# EAGLE design codm-wifi-pixel-controller (EAGLE 9.6.2)
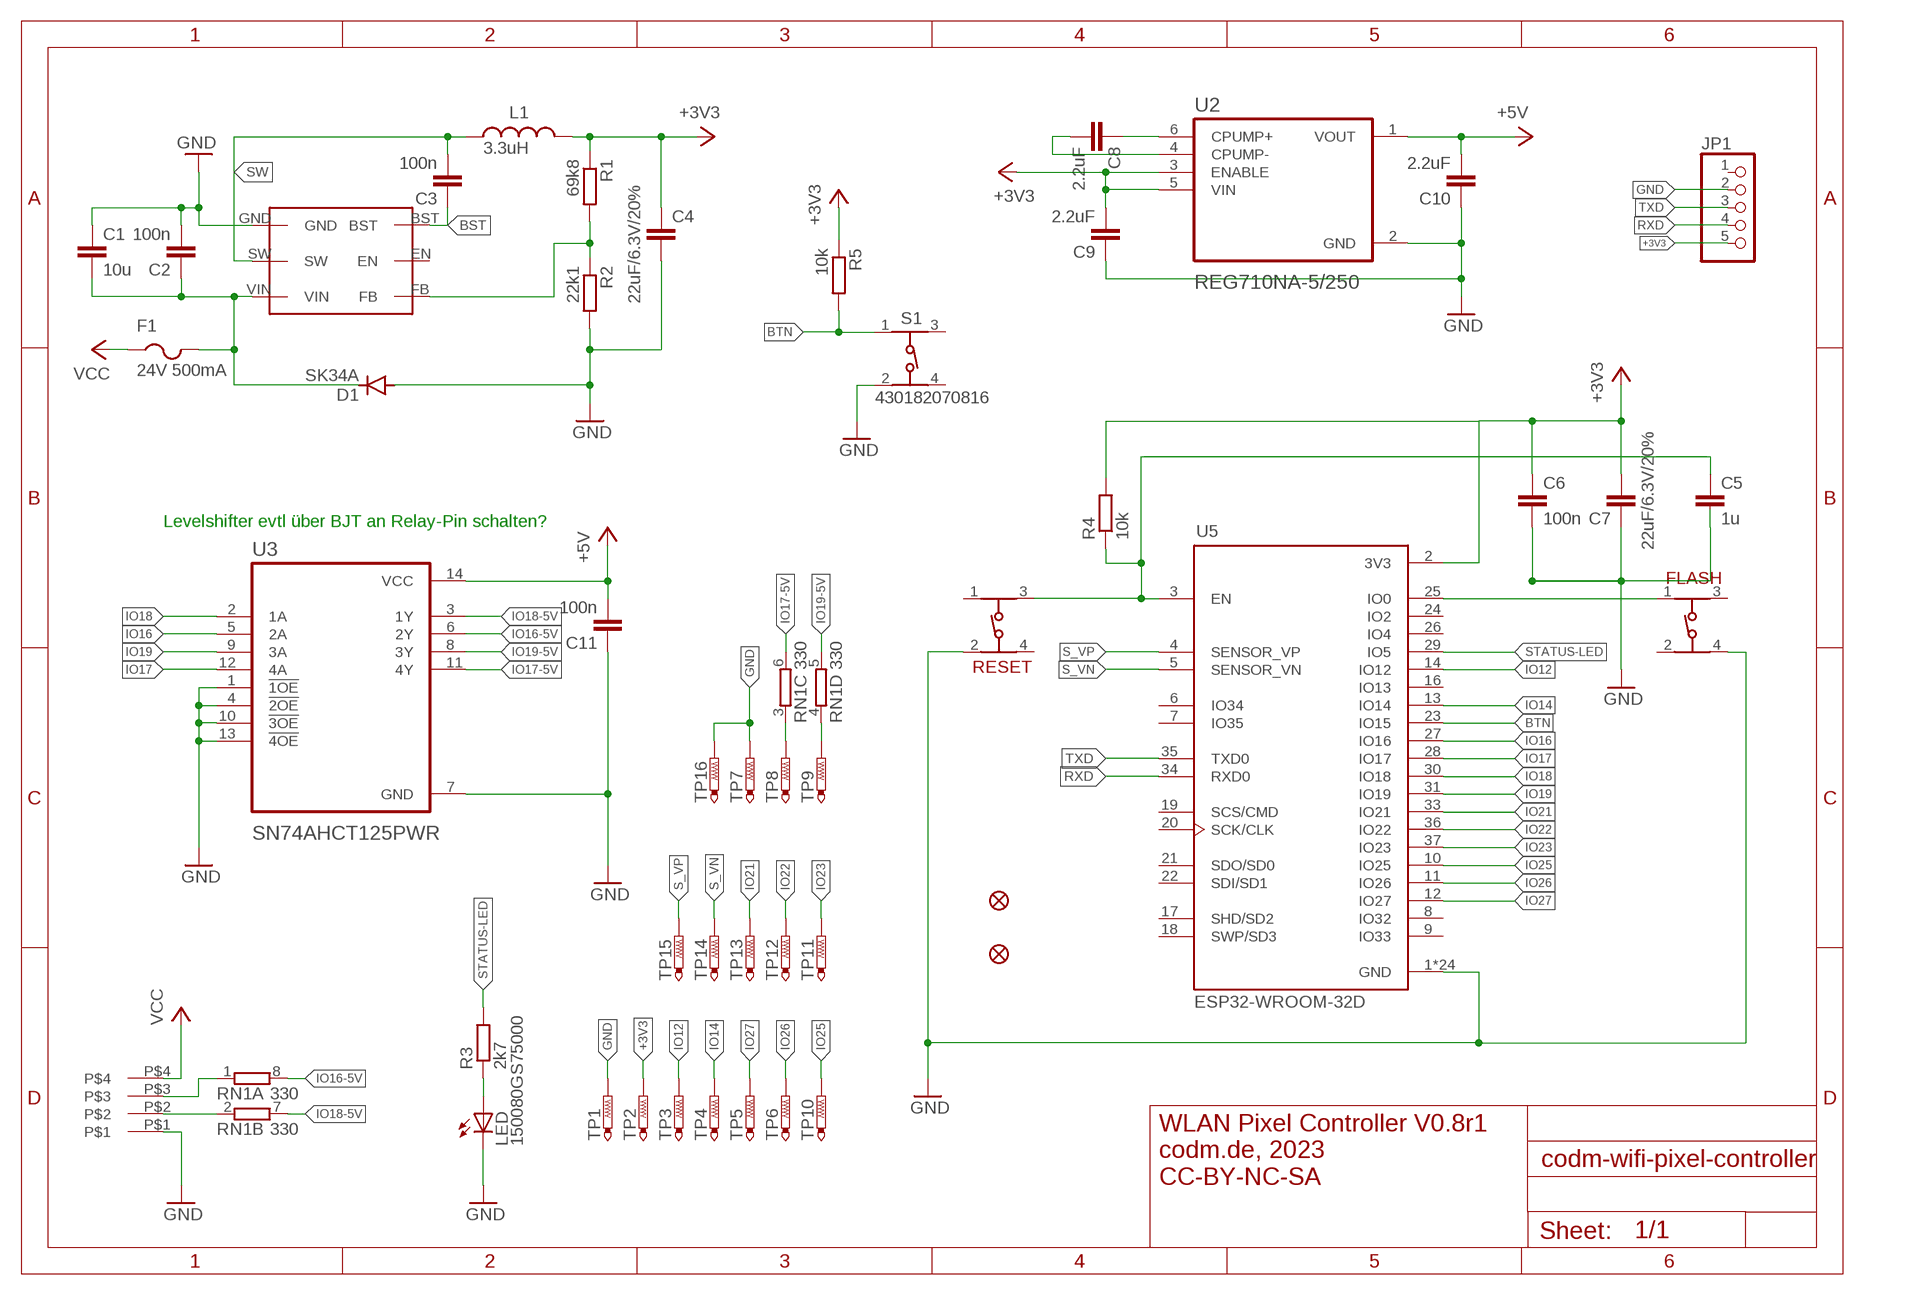
[diagram p0: schematic, sheet 1]

## Parts
C1  10u  C-EUC0805K  [C0805K]
C2  100n  C-EUC0603K  [C0603K]
C3  100n  C-EUC0603K  [C0603K]
C4  22uF/6.3V/20%  C-EUC0805K  [C0805K]
C5  1u  C-EUC0603K  [C0603K]
C6  100n  C-EUC0603K  [C0603K]
C7  22uF/6.3V/20%  C-EUC0805K  [C0805K]
C8  2.2uF  C-EUC0603K  [C0603K]
C9  2.2uF  C-EUC0603K  [C0603K]
C10  2.2uF  C-EUC0603K  [C0603K]
C11  100n  C-EUC0603K  [C0603K]
D1  SK34A  DIODE-DO214AC  [DO214AC]
F1  24V 500mA  PTCFUSE-1206  [R1206]
FD1  FIDUCIAL1X2  [FIDUCIAL-1X2]
FD2  FIDUCIAL1X2  [FIDUCIAL-1X2]
FLASH  434153017835  [434153017835]
JP1  PINHD-1X5  [1X05]
L1  3.3uH  WE-LQ_1812_744045003  [WE-LQ_1812]
LED  150080GS75000  LEDCHIP-LED0805  [CHIP-LED0805]
R1  69k8  R-EU_R0603  [R0603]
R2  22k1  R-EU_R0603  [R0603]
R3  2k7  R-EU_R0603  [R0603]
R4  10k  R-EU_R0603  [R0603]
R5  10k  R-EU_R0603  [R0603]
RESET  434153017835  [434153017835]
RN1  330  4R-NEXB38V  [EXB38V]
S1  430182070816  [430182070816]
TP1  PTR1TP14R  [TP14R]
TP2  PTR1TP14R  [TP14R]
TP3  PTR1TP14R  [TP14R]
TP4  PTR1TP14R  [TP14R]
TP5  PTR1TP14R  [TP14R]
TP6  PTR1TP14R  [TP14R]
TP7  PTR1TP14R  [TP14R]
TP8  PTR1TP14R  [TP14R]
TP9  PTR1TP14R  [TP14R]
TP10  PTR1TP14R  [TP14R]
TP11  PTR1TP14R  [TP14R]
TP12  PTR1TP14R  [TP14R]
TP13  PTR1TP14R  [TP14R]
TP14  PTR1TP14R  [TP14R]
TP15  PTR1TP14R  [TP14R]
TP16  PTR1TP14R  [TP14R]
U1  AP62XXX-TSOT26  [AP62XXX-TSOT26]
U2  REG710NA-5/250  [SOT95P280X145-6N]
U3  SN74AHCT125PWR  [SOP65P640X120-14N]
U5  ESP32-WROOM-32D  [MODULE_ESP32-WROOM-32D]
U$101  MCV-1,5/4-G-3,81  [MCV-1,5/4-G-3,81]

## Nets
+3V3: C4.1 C6.1 C7.2 C9.2 JP1.5 L1.2 R1.1 R4.2 R5.1 TP2.TP U2.3(ENABLE) U2.5(VIN) U5.2(3V3)
+5V: C10.2 C11.2 U2.1(VOUT) U3.14(VCC)
BST: C3.1 U1.BST
BTN: R5.2 S1.1 U5.23(IO15)
GND: C1.1 C2.2 C4.2 C5.2 C6.2 C7.1 C9.1 C10.1 C11.1 D1.A FLASH.4 JP1.2 LED.C R2.2 RESET.2 S1.2 TP1.TP TP7.TP TP16.TP U1.GND U2.2(GND) U3.1(!1OE) U3.4(!2OE) U3.7(GND) U3.10(!3OE) U3.13(!4OE) U5.1(GND) U5.15(GND) U5.38(GND) U5.39_1(GND) U5.39_2(GND) U5.39_3(GND) U5.39_4(GND) U5.39_5(GND) U5.39_6(GND) U5.39_7(GND) U5.39_8(GND) U5.39_9(GND) U5.39_10(GND) U5.39_11(GND) U5.39_12(GND) U5.39_13(GND) U5.39_14(GND) U5.39_15(GND) U5.39_16(GND) U5.39_17(GND) U5.39_18(GND) U5.39_19(GND) U5.39_20(GND) U5.39_21(GND) U$101.P$1
GPIO0: FLASH.1 U5.25(IO0)
IO12: TP3.TP U5.14(IO12)
IO14: TP4.TP U5.13(IO14)
IO16: U3.5(2A) U5.27(IO16)
IO16-5V: RN1.8 U3.6(2Y)
IO16-5VR: RN1.1 U$101.P$3
IO17: U3.12(4A) U5.28(IO17)
IO17-5V: RN1.6 U3.11(4Y)
IO17-5VR: RN1.3 TP8.TP
IO18: U3.2(1A) U5.30(IO18)
IO18-5V: RN1.7 U3.3(1Y)
IO18-5VR: RN1.2 U$101.P$2
IO19: U3.9(3A) U5.31(IO19)
IO19-5V: RN1.5 U3.8(3Y)
IO19-5VR: RN1.4 TP9.TP
IO21: TP13.TP U5.33(IO21)
IO22: TP12.TP U5.36(IO22)
IO23: TP11.TP U5.37(IO23)
IO25: TP10.TP U5.10(IO25)
IO26: TP6.TP U5.11(IO26)
IO27: TP5.TP U5.12(IO27)
N$5: C8.1 U2.6(CPUMP+)
N$6: R1.2 R2.1 U1.FB
N$7: LED.A R3.1
N$8: C8.2 U2.4(CPUMP-)
RESET: C5.1 R4.1 RESET.3 U5.3(EN)
RXD: JP1.4 U5.34(RXD0)
S_VN: TP14.TP U5.5(SENSOR_VN)
S_VP: TP15.TP U5.4(SENSOR_VP)
STATUS-LED: R3.2 U5.29(IO5)
SW: C3.2 L1.1 U1.SW
TXD: JP1.3 U5.35(TXD0)
VCC: F1.1 U$101.P$4
VCCF: C1.2 C2.1 D1.C F1.2 U1.VIN
Unconnected: FLASH.2 FLASH.3 JP1.1 RESET.1 RESET.4 S1.3 S1.4 U1.EN U5.6(IO34) U5.7(IO35) U5.8(IO32) U5.9(IO33) U5.16(IO13) U5.17(SHD/SD2) U5.18(SWP/SD3) U5.19(SCS/CMD) U5.20(SCK/CLK) U5.21(SDO/SD0) U5.22(SDI/SD1) U5.24(IO2) U5.26(IO4)

## Notes on the sheet
- Levelshifter evtl über BJT an Relay-Pin schalten?
- WLAN Pixel Controller V0.8r1
  codm.de, 2023
  CC-BY-NC-SA

## Library data of the parts
C1-C11 = rcl:C-EU: CAPACITOR, European symbol; SPICEPREFIX: C
D1 = diode:DIODE-: DIODE
F1 = adafruit:PTCFUSE: PTC fuses, resettable thermistors
FD1 FD2 = SparkFun-Aesthetics:FIDUCIAL: Fiducial Alignment Points Point-of-reference for pick-and-place machines and other optical instruments.
FLASH RESET = 434153017835_Eagle_WS-TASV_rev20a:434153017835: WS-TASV J-Bend SMT Tact Switch 3.5x2.9 mm Material Properties Cover Material : Stainless Steel Properties Actuator Material:LCP Actuator Flammability Rating:UL94 V-0 Actuator Color:Blue Frame Material:PA46 Frame Flammability Rating:UL94 HB Frame Color:Black Contact Material:Stainless Steel Contact Plating:Silver Terminal Material:Copper Alloy Terminal Plating:Silver VR:12 V (DC) Contact Resistance Initial:100 mΩ Contact Resistance After Life Test:1 Ω RISO:100 MΩ Withstanding Voltage:250 V (AC) Washable:No Qty.:4000 Mechanical Properties Stroke :0.15 mm General Information Operating Temperature:-40 up to +85 °C Washable:No Packaging Properties Packaging:Tape and Reel <https://www.we-online.com/catalog/media/o72753v209%20WS-TASU_434331013822_a_4C.jpg> Details see: https://www.we-online.com/catalog/en/TASV_3_5X2_9_SMD_J-BEND/ Updated by yingchun,Shan;2020-02-18 2020(C) Würth Elektronik; DATASHEET-URL: https://www.we-online.com/catalog/datasheet/434153017835.pdf; H: 1.7mm; OPERATION-FORCE: 350g; PART-NUMBER: 434153017835; QTY: 4000
JP1 = codm:PINHD-1X5: PIN HEADER
L1 = Eagle_WE-LQ (rev19a):WE-LQ_1812: WE-LQ SMD Inductor Characteristics Miniature chip inductor wound on a special ferrite core Small inductances for compact circuits High Q at high frequencies Low DC-resistance Operating temperature: –40 ºC to +125 ºC Recommended solder profile: Reflow Applications Low power DC/DC-converters from Linear Technology, National Semiconductor, Texas Instruments, Fairchild Semiconductor, ON Semiconductor, STMicroelectronics, Maxim, MPS, Semtech, Exar, Analogic Tech, Diodes and Cologne Chip EMI-Filtering RF-circuits <https://katalog.we-online.com/media/images/v2/o14806v209%20Family_we-lq_smd_induktivitaet.jpg> Details see: https://katalog.we-online.com/en/pbs/WE-LQ Updated by Yingchun Shan 2019-07-16 2019 (C) Wurth Elektronik; DATASHEET-URL: https://katalog.we-online.com/pbs/datasheet/744045003.pdf; FRES: 58MHz; IR: 1.4A; ISAT: 2.7A; PART-NUMBER: 744045003; Q: 45; RDC-MAX: 0.13Ohm
LED = led:LED: LED OSRAM: - CHIPLED LG R971, LG N971, LY N971, LG Q971, LY Q971, LO R971, LY R971 LH N974, LH R974 LS Q976, LO Q976, LY Q976 LO Q996 - Hyper CHIPLED LW Q18S LB Q993, LB Q99A, LB R99A - SideLED LS A670, LO A670, LY A670, LG A670, LP A670 LB A673, LV A673, LT A673, LW A673 LH A674 LY A675 LS A676, LA A676, LO A676, LY A676, LW A676 LS A679, LY A679, LG A679 - Hyper Micro SIDELED® LS Y876, LA Y876, LO Y876, LY Y876 LT Y87S - SmartLED LW L88C, LW L88S LB L89C, LB L89S, LG L890 LS L89K, LO L89K, LY L89K LS L896, LA L896, LO L896, LY L896 - TOPLED LS T670, LO T670, LY T670, LG T670, LP T670 LSG T670, LSP T670, LSY T670, LOP T670, LYG T670 LG T671, LOG T671, LSG T671 LB T673, LV T673, LT T673, LW T673 LH T674 LS T676, LA T676, LO T676, LY T676, LB T676, LH T676, LSB T676, LW T676 LB T67C, LV T67C, LT T67C, LS T67K, LO T67K, LY T67K, LW E67C LS E67B, LA E67B, LO E67B, LY E67B, LB E67C, LV E67C, LT E67C LW T67C LS T679, LY T679, LG T679 LS T770, LO T770, LY T770, LG T770, LP T770 LB T773, LV T773, LT T773, LW T773 LH T774 LS E675, LA E675, LY E675, LS T675 LS T776, LA T776, LO T776, LY T776, LB T776 LHGB T686 LT T68C, LB T68C - Hyper Mini TOPLED® LB M676 - Mini TOPLED Santana® LG M470 LS M47K, LO M47K, LY M47K Source: http://www.osram.convergy.de LUXEON: - LUMILED® LXK2-PW12-R00, LXK2-PW12-S00, LXK2-PW14-U00, LXK2-PW14-V00 LXK2-PM12-R00, LXK2-PM12-S00, LXK2-PM14-U00 LXK2-PE12-Q00, LXK2-PE12-R00, LXK2-PE12-S00, LXK2-PE14-T00, LXK2-PE14-U00 LXK2-PB12-K00, LXK2-PB12-L00, LXK2-PB12-M00, LXK2-PB14-N00, LXK2-PB14-P00, LXK2-PB14-Q00 LXK2-PR12-L00, LXK2-PR12-M00, LXK2-PR14-Q00, LXK2-PR14-R00 LXK2-PD12-Q00, LXK2-PD12-R00, LXK2-PD12-S00 LXK2-PH12-R00, LXK2-PH12-S00 LXK2-PL12-P00, LXK2-PL12-Q00, LXK2-PL12-R00 Source: www.luxeon.com KINGBRIGHT: KA-3528ASYC Source: www.kingbright.com
R1-R5 = rcl:R-EU_: RESISTOR, European symbol; SPICEPREFIX: R
RN1 = resistor-dil:4R-N: Array Chip Resistor Source: RS Component / Phycomp; OC_FARNELL: unknown; OC_NEWARK: unknown
S1 = Eagle_WS-TASV (rev21c):430182070816: WS-TASV SMT Tact Switch 6x6 mm Material Properties Cover Material : Stainless Steel Properties Actuator Material:LCP Actuator Flammability :UL94 V-0 Rating Actuator Color:Black; Salmon; White Frame Material:LCP Flammability Rating:UL94 V-0 Frame Color:Black Contact Material:Stainless Steel Contact Plating:Silver Terminal Material:Copper Alloy Terminal Plating:Silver VR:12 V (DC) Contact Resistance Initial:100 mΩ Contact Resistance After Life Test:2Ω RISO:100 MΩ Withstanding Voltage:250 V (AC) Washable:No Qty.:4000;5000 Mechanical Properties Electrical Life:400; 550; 1000 Stroke :0.25 mm General Information Operating Temperature:-40 up to +85 °C Washable:No Packaging Properties Packaging:Tape and Reel <https://www.we-online.com/catalog/media/o37470v209%20Family_WS-TASV_6x6mm_SMD_Tact_Switch_4301820xx8xx.jpg> Details see: https://www.we-online.com/catalog/en/TASV_6X6_SMD/ Updated by yingchun,Shan;2020-02-18 2020(C) Würth Elektronik; DATASHEET-URL: https://www.we-online.com/catalog/datasheet/430182070816.pdf; H: 7mm; OPERATION-FORCE: 160g; PART-NUMBER: 430182070816; QTY: 550
TP1-TP16 = testpad:PTR1: TEST PIN
U1 = codm:AP62XXX-TSOT26
U2 = REG710NA-5_250:REG710NA-5/250: Check prices <https://pricing.snapeda.com/parts/REG710NA-5/250/Texas%20Instruments/view-part?ref=eda>; AVAILABILITY: In Stock; DESCRIPTION: 30-mA Switched-Cap DC-DC Converter with fixed 5-V Output 6-SOT-23 -40 to 85; MF: Texas Instruments; MP: REG710NA-5/250; PACKAGE: SOT-23-6 Texas Instruments; PRICE: None; PURCHASE-URL: https://pricing.snapeda.com/search/part/REG710NA-5/250/?ref=eda
U3 = SN74AHCT125PWR:SN74AHCT125PWR: Check availability <https://pricing.snapeda.com/parts/SN74AHCT125PWR/Texas%20Instruments/view-part?ref=eda>; AVAILABILITY: In Stock; DESCRIPTION: Quadruple Bus Buffer Gates With 3-State Outputs 14-TSSOP -40 to 125; MF: Texas Instruments; MP: SN74AHCT125PWR; PACKAGE: TSSOP-14 Texas Instruments; PRICE: None; PURCHASE-URL: https://pricing.snapeda.com/search/part/SN74AHCT125PWR/?ref=eda
U5 = ESP32-WROOM-32D:ESP32-WROOM-32D: Bluetooth, WiFi 802.11b/g/n, Bluetooth v4.2 + EDR, Class 1, 2 and 3 Transceiver Module 2.4GHz ~ 2.5GHz Integrated, Trace Surface Mount Check availability <https://pricing.snapeda.com/parts/ESP32-WROOM-32D/Espressif%20Systems/view-part?ref=eda>; AVAILABILITY: In Stock; DESCRIPTION: Bluetooth, WiFi 802.11b/g/n, Bluetooth v4.2 +EDR, Class 1, 2 and 3 Transceiver Module 2.4GHz ~ 2.5GHz Integrated; MF: Espressif Systems; MP: ESP32-WROOM-32D; PACKAGE: Module Espressif Systems; PRICE: None; PURCHASE-URL: https://pricing.snapeda.com/search/part/ESP32-WROOM-32D/?ref=eda
U$101 = codm:MCV-1,5/4-G-3,81

## Board
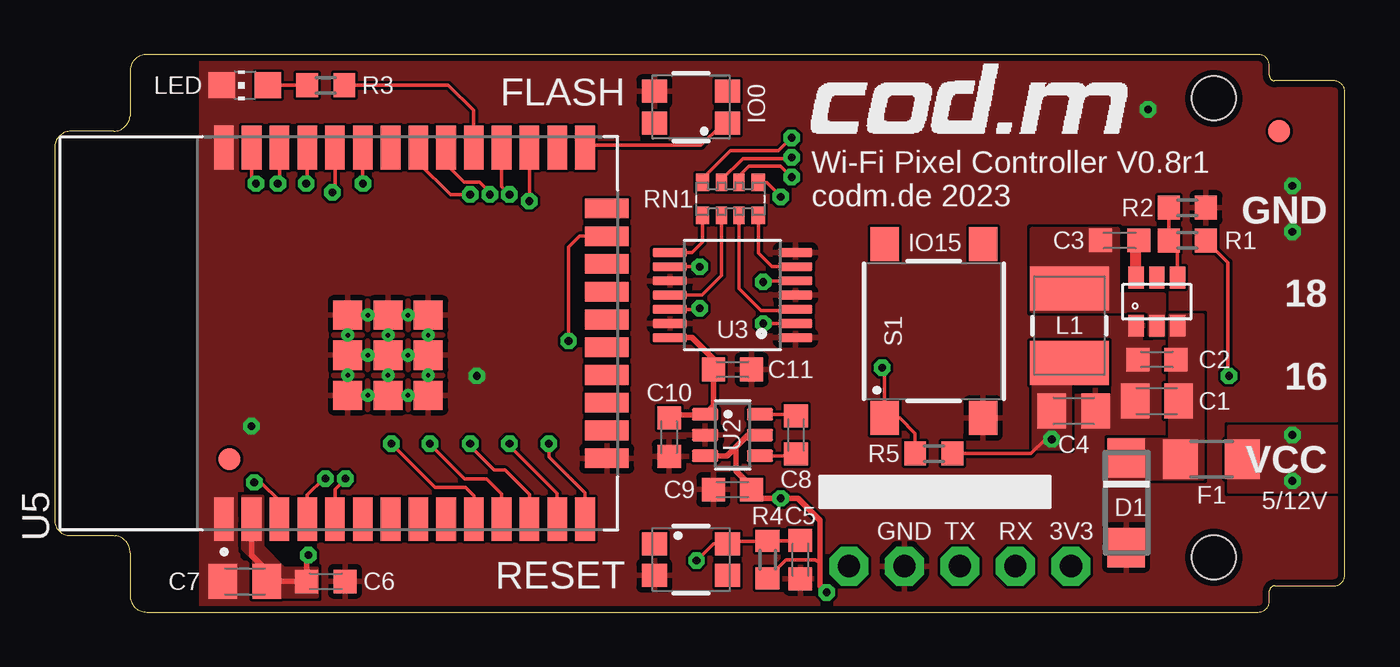
[diagram p1: board, top side]
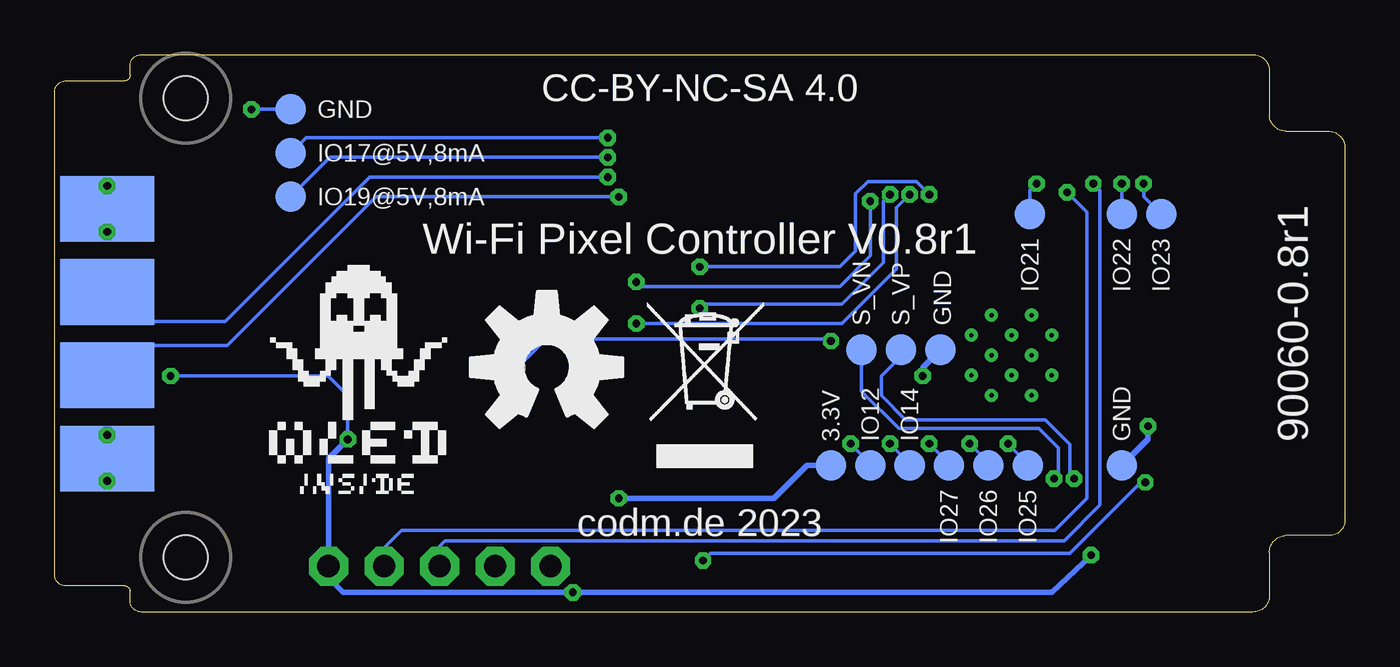
[diagram p2: board, bottom side, seen from below]

Size 59 x 25.5 mm. Coordinates in mm from the lower left corner, seen from the top.
Outline: 2.7,22 0.75,22 0.69,22 arc85 0,21.25 0,4.2 arc90 0.7,3.5 2.7,3.5 2.77,3.5 arc-85 3.45,2.7 3.45,0.75 3.45,0.69 arc85 4.2,0 55.05,0 55.09,0 arc85 55.55,0.5 55.55,0.95 55.55,0.97 arc-85 55.8,1.2 58.5,1.2 58.54,1.2 arc85 59,1.7 59,23.8 59,23.84 arc85 58.5,24.3 55.8,24.3 55.78,24.3 arc-85 55.55,24.55 55.55,25 55.55,25.04 arc85 55.05,25.5 4.2,25.5 4.13,25.5 arc85 3.45,24.75 3.45,22.75 3.45,22.68 arc-85 2.7,22
Copper layers (1*16): Top 0.035mm / dielectric 1.5mm / Bottom 0.035mm
Design rules "aisler_2_layer_complex": minimum track width 0.125mm, minimum drill 0.2mm, track to track 0.125mm, track to pad 0.125mm, pad to pad 0.125mm, via to via 0.125mm, smd to smd 0.125mm, copper to edge 0.3mm, drill to drill 0.25mm, minimum pad ring 0.2mm, minimum via ring 0.2mm, stop-mask expansion 0mil, vias tented up to drill 0mil, thermal gap 10mil
Holes 2 mm at 53,23.5 53,2.5

### Footprints (pad centres in the part's own frame; a part is rotated, then mirrored left to right if it is on the bottom)
C0805K = smd 1.3 x 1.6: 1 -1,0; 2 1,0
C0603K = smd 1.05 x 1.08: 1 -0.875,0; 2 0.875,0
DO214AC = smd 1.8 x 1.7: A 2.05,0; C -2.05,0
R1206 = smd 1.6 x 1.803: 1 -1.422,0; 2 1.422,0
FIDUCIAL-1X2 = smd 1 x 1: 1 0,0
434153017835 = smd 1.15 x 1.05: 1 -1.675,0.725; 2 -1.675,-0.725; 3 1.675,0.725; 4 1.675,-0.725
1X05 = drill 1.016 pad 1.778 octagon: 1 -5.08,0; 2 -2.54,0; 3 0,0; 4 2.54,0; 5 5.08,0
WE-LQ_1812 = smd 2 x 3.6: 1 -1.7,0; 2 1.7,0
CHIP-LED0805 = smd 1.2 x 1.2: A 0,-1.05; C 0,1.05
R0603 = smd 1 x 1.1: 1 -0.85,0; 2 0.85,0
EXB38V = smd 0.6 x 0.8: 1 -1.275,-0.75; 4 1.275,-0.75; 5 1.275,0.75; 8 -1.275,0.75 | smd 0.5 x 0.8: 2 -0.4,-0.75; 3 0.4,-0.75; 6 0.4,0.75; 7 -0.4,0.75
430182070816 = smd 1.55 x 1.3: 1 -3.975,2.25; 2 -3.975,-2.25; 3 3.975,2.25; 4 3.975,-2.25
TP14R = smd 1.4 x 1.4: TP 0,0
AP62XXX-TSOT26 = smd 1 x 0.7: BST 1.1,0.95; EN 1.1,0; FB 1.1,-0.95; GND -1.1,0.95; SW -1.1,0; VIN -1.1,-0.95
SOT95P280X145-6N = smd 1.21 x 0.58: 1 -1.255,0.95; 2 -1.255,0; 3 -1.255,-0.95; 4 1.255,-0.95; 5 1.255,0; 6 1.255,0.95
SOP65P640X120-14N = smd 1.57 x 0.41: 1 -2.87,1.95; 2 -2.87,1.3; 3 -2.87,0.65; 4 -2.87,0; 5 -2.87,-0.65; 6 -2.87,-1.3; 7 -2.87,-1.95; 8 2.87,-1.95; 9 2.87,-1.3; 10 2.87,-0.65; 11 2.87,0; 12 2.87,0.65; 13 2.87,1.3; 14 2.87,1.95
MODULE_ESP32-WROOM-32D = smd 2 x 0.9: 1 -8.5,5.26; 2 -8.5,3.99; 3 -8.5,2.72; 4 -8.5,1.45; 5 -8.5,0.18; 6 -8.5,-1.09; 7 -8.5,-2.36; 8 -8.5,-3.63; 9 -8.5,-4.9; 10 -8.5,-6.17; 11 -8.5,-7.44; 12 -8.5,-8.71; 13 -8.5,-9.98; 14 -8.5,-11.25; 25 8.5,-11.25; 26 8.5,-9.98; 27 8.5,-8.71; 28 8.5,-7.44; 29 8.5,-6.17; 30 8.5,-4.9; 31 8.5,-3.63; 32 8.5,-2.36; 33 8.5,-1.09; 34 8.5,0.18; 35 8.5,1.45; 36 8.5,2.72; 37 8.5,3.99; 38 8.5,5.26 | smd 0.9 x 2: 15 -5.715,-12.25; 16 -4.445,-12.25; 17 -3.175,-12.25; 18 -1.905,-12.25; 19 -0.635,-12.25; 20 0.635,-12.25; 21 1.905,-12.25; 22 3.175,-12.25; 23 4.445,-12.25; 24 5.715,-12.25 | smd 1.33 x 1.33: 39_1 -2.835,-0.405; 39_2 -1,-0.405; 39_3 0.835,-0.405; 39_4 -2.835,-2.24; 39_5 -1,-2.24; 39_6 0.835,-2.24; 39_7 -2.835,-4.075; 39_8 -1,-4.075; 39_9 0.835,-4.075 | drill 0.2 pad 0.3: 39_10 -1.917,-0.405; 39_11 -0.083,-0.405; 39_12 -2.835,-1.323; 39_13 -1,-1.323; 39_14 0.835,-1.323; 39_15 -1.917,-2.24; 39_16 -0.083,-2.24; 39_17 -2.835,-3.158; 39_18 -1,-3.158; 39_19 0.835,-3.158; 39_20 -1.917,-4.075; 39_21 -0.083,-4.075
MCV-1,5/4-G-3,81 = smd 4.3 x 3: P$1 0,-5.7; P$2 0,-1.89; P$3 0,1.92; P$4 0,5.73

### Placement (x,y rotation side)
C1  50.4,9.65 0 top
C2  50.4,11.55 180 top
C3  48.7,17 180 top
C4  46.6,9.2 0 top
C5  34.1,2.4 270 top
C6  12.4,1.4 0 top
C7  8.7,1.4 0 top
C8  33.9,8.1 270 top
C9  31,5.6 0 top
C10  28.1,8 90 top
C11  31,11.1 180 top
D1  49,5 270 top
F1  52.9,7 180 top
FD1  8,7 0 top
FD2  56,22 0 top
FLASH  29.1,23.1 180 top
JP1  41.4,2.1 0 top
L1  46.4,13.1 270 top
LED  8.7,24.1 90 top
R1  51.8,17 180 top
R2  51.8,18.5 0 top
R3  12.4,24.1 0 top
R4  32.6,2.4 270 top
R5  40.2,7.25 180 top
RESET  29.1,2.4 0 top
RN1  30.9,18.9 180 top
S1  40.2,12.85 90 top
TP1  10.2,6.7 0 bottom
TP2  23.5,6.7 0 bottom
TP3  21.7,6.7 0 bottom
TP4  19.9,6.7 0 bottom
TP5  18.1,6.7 0 bottom
TP6  16.3,6.7 0 bottom
TP7  48.2,23 0 bottom
TP8  48.2,19 0 bottom
TP9  48.2,21 0 bottom
TP10  14.5,6.7 0 bottom
TP11  8.4,18.2 0 bottom
TP12  10.2,18.2 0 bottom
TP13  14.4,18.2 0 bottom
TP14  22.1,12 0 bottom
TP15  20.3,12 0 bottom
TP16  18.5,12 0 bottom
U1  50.4,14.2 90 top
U2  31,8.1 0 top
U3  31,14.5 180 top
U5  13,12.75 90 top
U$1  [CODM-LOGO]  34.6,21.9 0 top
U$2  [WLED-INSIDE-LOGO-10MM]  49.3,5.2 0 bottom
U$100  [WEEE-LOGO-5MM]  31.9,6.6 0 bottom
U$101  56.6,12.75 180 bottom
U$102  [OSHW-LOGO-L]  36.5,11.2 0 bottom

### Tracks (layer width: path | path; a pad name or v marks a point on that pad's centre or on a via)
+3V3  (via drill 0.35)
  Top 0.152: R1.1 53.65,16 53.65,10.85 v53.7,10.8 | R5.1 44.65,7.25 45.3,7.9 v45.6,7.9 | R4.2 33.45,2.4 34.8,2.4 35,2.2
  Top 0.254: v11.6,2.6 11.53,2.52 C6.1 C7.2 9.7,1.9 9.01,2.59 U5.2 | U2.5 31.7,8.1 31.15,7.55 | U2.3 30.75,7.15 31.15,7.55 | 31.15,7.55 31.15,6.45 32,5.6 | 32,5.6 32.4,5.2 v33.2,5.2 34,5.2 35,4.2 35,2.2 35,1.2 v35.3,0.9 | C9.2 32,5.6
  Bottom 0.152: v53.7,10.8 46.5,10.8 45.6,9.9 v45.6,7.9
  Bottom 0.254: v11.6,2.6 13.4,0.9 v35.3,0.9 45.8,0.9 46.48,1.58 JP1.5 46.48,7.02 v45.6,7.9 | TP2.TP 24.6,6.7 26.1,5.2 v33.2,5.2
  pour Top (no thermals): 46.4,7.5 44.8,7.5 44.8,12.3 48.1,12.3 48.1,10.6 46.4,10.6
  pour Top (no thermals): 9.1,0.7 9.1,2.4 8.6,2.9 8.6,5.3 9.5,5.3 9.5,3 10.5,2 12,2 12,0.7
+5V
  Top 0.152: U2.1 29.71,9.02 | 28.15,9.02 C10.2
  Top 0.254: 29.71,9.02 28.15,9.02 | U3.14 29.15,12.55 30.12,11.57 C11.2 30.12,9.43 U2.1
BST
  Top 0.254: 49.45,16.88 C3.1
  Top 0.508: U1.BST 49.45,16.88
BTN  (via drill 0.35)
  Top 0.152: v23.5,12.4 23.5,16.7 23.9,17.1 24,17.2 U5.23 | R5.2 39.35,8.18 38.65,8.88 S1.1 37.95,11.07 v37.85,11.18
  Bottom 0.152: v23.5,12.4 23.6,12.5 36.52,12.5 v37.85,11.18
GND  (via drill 0.35)
  Bottom 0.152: TP7.TP v50,23
  Bottom 0.254: TP1.TP 9,7.9 v9,8.5 | TP16.TP 19.3,11.2 v19.3,10.8
  Bottom 0.508: v56.6,17.4 U$101.P$1 v56.6,19.5
  pour Top (rank 3): 6.73,0 59,0 59,25.4 6.73,25.4
  pour Top (rank 2, no thermals): 44.6,9.9 44.6,5.6 50.6,5.6 50.6,12.35 49.7,12.35 49.7,13.4 48.4,13.4 48.4,9.9
  pour Top (no thermals): 6.7,-0.1 6.7,5.5 8.3,5.5 8.3,2.6 8.6,2.3 8.6,-0.1
  pour Top (no thermals): 6.7,20 8.8,20 8.8,24.9 6.7,24.9
GPIO0
  Top 0.152: FLASH.1 30.48,22.26 29.56,21.35 24.35,21.35 U5.25
IO12  (via drill 0.35)
  Top 0.152: U5.14 24.25,5.45 22.6,7.1 v22.6,7.7
  Bottom 0.152: v22.6,7.7 21.7,6.8 TP3.TP
IO14  (via drill 0.35)
  Top 0.152: U5.13 22.98,5.42 20.8,7.6 v20.8,7.7
  Bottom 0.152: TP4.TP 19.9,6.8 v20.8,7.7
IO16  (via drill 0.35)
  Top 0.152: v32.4,15.1 32.45,15.15 U3.5 | U5.27 v21.71,18.81 v21.7,18.8
  Bottom 0.152: v21.7,18.8 21.7,16.3 23.1,14.9 32.2,14.9 v32.4,15.1
IO16-5V
  Top 0.152: RN1.8 32.17,16.43 32.8,15.8 U3.6
IO16-5VR  (via drill 0.35)
  Top 0.152: v33.2,19 33.2,19.02 32.58,19.65 RN1.1
  Bottom 0.152: U$101.P$3 55.7,11.73 55.7,12.1 55.6,12.2 51.1,12.2 44.3,19 v33.2,19
IO17  (via drill 0.35)
  Top 0.152: v29.5,13.9 29.45,13.85 U3.12 | v20.8,19.1 20.44,19.46 U5.28
  Bottom 0.152: v20.8,19.1 21.1,18.8 21.1,16 23,14.1 29.3,14.1 v29.5,13.9
IO17-5V
  Top 0.152: RN1.6 30.5,15.4 29.6,14.5 U3.11
IO17-5VR  (via drill 0.35)
  Top 0.152: RN1.3 30.5,19.79 31.47,20.75 33.65,20.75 v33.7,20.8
  Bottom 0.152: v33.7,20.8 46.4,20.8 TP8.TP
IO18  (via drill 0.35)
  Top 0.152: v19.9,19.1 19.9,19.21 19.44,19.68 18.72,19.68 17.9,20.5 U5.30 | v32.4,13.2 U3.2
  Bottom 0.152: v19.9,19.1 20.5,18.5 20.5,15.7 23,13.2 v32.4,13.2
IO18-5V
  Top 0.152: RN1.7 31.3,14.8 32.3,13.8 33.82,13.8 U3.3
IO18-5VR  (via drill 0.35)
  Top 0.152: v33.7,19.9 33.2,20.4 31.75,20.4 31.3,19.95 RN1.2
  Bottom 0.152: v33.7,19.9 44.6,19.9 51.2,13.3 56.6,13.3 U$101.P$2
IO19  (via drill 0.35)
  Top 0.152: v19,19.1 18.1,19.1 16.63,20.57 U5.31 | v29.5,15.8 U3.9
  Bottom 0.152: v19,19.1 19.6,19.7 21.82,19.7 22.38,19.14 22.38,16.52 23.1,15.8 v29.5,15.8
IO19-5V
  Top 0.152: U3.8 29.15,16.45 29.62,16.93 RN1.5
IO19-5VR  (via drill 0.35)
  Top 0.152: RN1.4 29.62,19.82 30.9,21.1 33.1,21.1 v33.7,21.7
  Bottom 0.152: TP9.TP 47.5,21.7 v33.7,21.7
IO21  (via drill 0.35)
  Top 0.152: U5.33 v14.09,19.61 v14.1,19.6
  Bottom 0.152: v14.1,19.6 14.4,19.3 TP13.TP
IO22  (via drill 0.35)
  Top 0.152: U5.36 10.28,19.68 v10.2,19.6
  Bottom 0.152: v10.2,19.6 TP12.TP
IO23  (via drill 0.35)
  Top 0.152: U5.37 9.01,19.79 v9.2,19.6
  Bottom 0.152: v9.2,19.6 9.2,19 TP11.TP
IO25  (via drill 0.35)
  Top 0.152: U5.10 19.17,5.32 18.79,5.7 17.4,5.7 v15.4,7.7
  Bottom 0.152: TP10.TP 14.5,6.8 v15.4,7.7
IO26  (via drill 0.35)
  Top 0.152: v17.15,7.7 18.75,6.1 19.75,6.1 20.44,5.42 U5.11
  Bottom 0.152: TP6.TP 16.3,6.85 v17.15,7.7
IO27  (via drill 0.35)
  Top 0.152: U5.12 21.71,5.39 20.6,6.5 20.1,6.5 19,7.6 v19,7.7
  Bottom 0.152: v19,7.7 18.1,6.8 TP5.TP
N$5
  Top 0.152: U2.6 33.83,9.05 C8.1
N$6
  Top 0.152: U1.FB 51.35,16.6 R1.2 R2.1
N$7
  Top 0.152: LED.A R3.1
N$8
  Top 0.152: U2.4 33.83,7.15 C8.2
RESET  (via drill 0.35)
  Top 0.152: C5.1 34.08,3.25 R4.1 32.58,3.23 30.57,3.23 RESET.3 30.12,3.12 v29.35,2.35 | U5.3 10.28,5.08 9.43,5.93 v9.12,5.93
  Bottom 0.152: v29.35,2.35 29.01,2.69 12.57,2.69 9.32,5.93 v9.12,5.93
RXD  (via drill 0.35)
  Top 0.152: U5.34 12.82,19.32 v12.7,19.2
  Bottom 0.152: v12.7,19.2 11.8,18.3 11.8,5.19 13.25,3.74 43.14,3.74 43.94,2.94 JP1.4
S_VN  (via drill 0.35)
  Top 0.152: v13.3,6.1 12.82,5.62 U5.5
  Bottom 0.152: v13.3,6.1 13.1,6.3 13.1,7.5 14,8.4 20.4,8.4 22.1,10.1 TP14.TP
S_VP  (via drill 0.35)
  Top 0.152: v12.38,6.1 12.3,6.1 11.55,5.35 U5.4
  Bottom 0.152: v12.38,6.1 12.58,6.3 12.58,7.68 13.7,8.8 20.1,8.8 21.2,9.9 21.2,10.8 20.3,11.7 TP15.TP
STATUS-LED
  Top 0.152: U5.29 19.15,21.27 19.15,22.95 18,24.1 R3.2
SW
  pour Top (rank 2, no thermals): 50.7,12.7 50.7,14.5 48.6,14.5 48.6,17.5 44.7,17.5 44.7,13.8 50.1,13.8 50.1,12.7
TXD  (via drill 0.35)
  Top 0.152: U5.35 11.55,19.65 v11.5,19.6
  Bottom 0.152: v11.5,19.6 11.2,19.3 11.2,4.9 12.84,3.27 41.13,3.27 41.4,3 JP1.3
VCC  (via drill 0.35)
  Bottom 0.152: U$101.P$4 56.17,6.59 v56.6,6
  other vias: 56.6,8.1
  pour Top (no thermals): 53.7,5.5 53.7,8.5 58.9,8.5 58.9,5.5
VCCF
  pour Top (no thermals): 52.5,6.1 48.2,6.1 48.2,7.9 51,7.9 51,13.6 52.5,13.6

### Text on the board
tNames: IO0 | Wi-Fi Pixel Controller V0.8r1 / codm.de 2023 | GND | IO15 | 18 | 16 | VCC | 5/12V | GND | TX | RX | 3V3
bNames: CC-BY-NC-SA 4.0 | GND | IO17@5V,8mA | IO19@5V,8mA | IO23 | IO22 | IO21 | Wi-Fi Pixel Controller V0.8r1 | 90060-0.8r1 | GND | S_VP | S_VN | GND | IO14 | IO12 | 3.3V | IO25 | IO26 | IO27 | codm.de 2023
tStop: CC-BY-NC-SA